# Altium schematic sheet GaN_Dead_Time.SchDoc
size A4
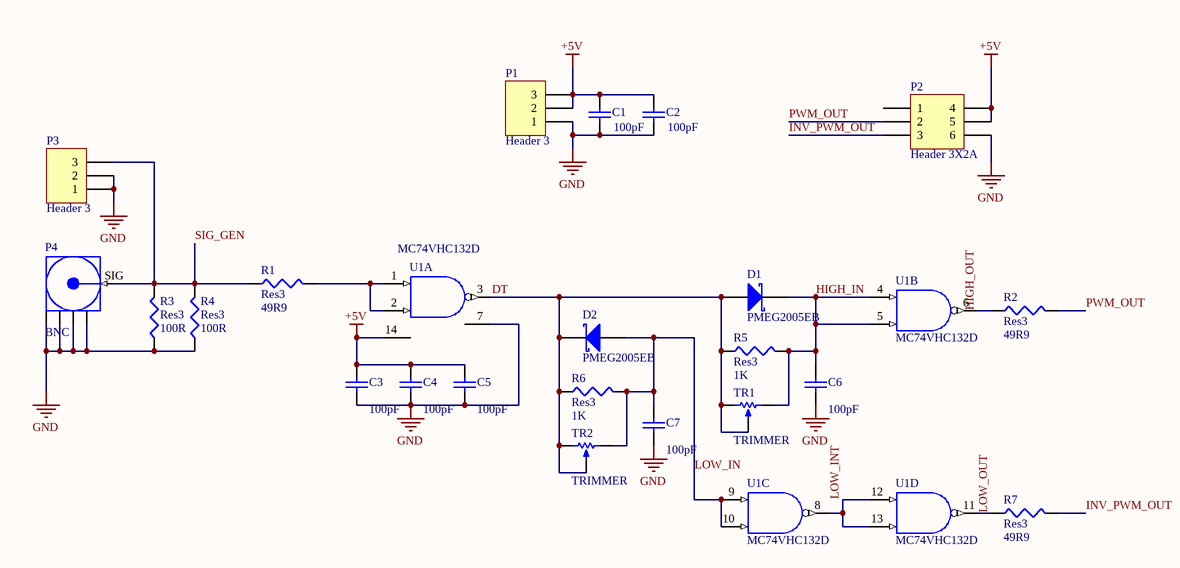
[diagram p0: GaN_Dead_Time.SchDoc]

## Parts
C1  value 100pF  [1206 IPC Low Density]  (hidden comment: Cap Semi)
C2  value 100pF  [1206 IPC Low Density]  (hidden comment: Cap Semi)
C3  value 100pF  [0603 IPC Low Density]  (hidden comment: Cap Semi)
C4  value 100pF  [0603 IPC Low Density]  (hidden comment: Cap Semi)
C5  value 100pF  [0603 IPC Low Density]  (hidden comment: Cap Semi)
C6  value 100pF  [0603 IPC Low Density]  (hidden comment: Cap Semi)
C7  value 100pF  [0603 IPC Low Density]  (hidden comment: Cap Semi)
D1  PMEG2005EB  [SOD-523]
D2  PMEG2005EB  [SOD-523]
P1  Header 3  [HDR1X3]
P2  Header 3X2A  [HDR2X3_CEN]
P3  Header 3  [HDR1X3]
P4  BNC  [BNC]
R1  Res3  value 49R9  [RESISTOR 0603]
R2  Res3  value 49R9  [RESISTOR 0603]
R3  Res3  value 100R  [RESISTOR 1206]
R4  Res3  value 100R  [RESISTOR 1206]
R5  Res3  value 1K  [RESISTOR 0603]
R6  Res3  value 1K  [RESISTOR 0603]
R7  Res3  value 49R9  [RESISTOR 0603]
TR1  TRIMMER  [3296W]
TR2  TRIMMER  [3296W]
U1  MC74VHC132D  [751A-03_M]  (parts A,B,C,D of 4)

## Nets
+5V: C1.2 C2.2 C3.2 C4.2 C5.2 P1.2 P1.3 P2.4 P2.5 U1.14(VDD)  [also labelled VDD]
GND: C1.1 C2.1 C3.1 C4.1 C5.1 C6.1 C7.1 P1.1 P2.6 P3.1 P3.2 P4.GND R3.1 R4.1 U1.7(GND)
DT: D1.1(A) D2.3(K) R5.1 R6.1 TR1.1(TOP) TR1.2(TAP) TR2.1(TOP) TR2.2(TAP) U1.3(Y)
HIGH_IN: C6.2 D1.3(K) R5.2 TR1.3(BOT) U1.4(A) U1.5(B)
HIGH_OUT: R2.1 U1.6(Y)
INV_PWM_OUT: P2.3 R7.2
LOW_IN: C7.2 D2.1(A) R6.2 TR2.3(BOT) U1.9(A) U1.10(B)
LOW_INT: U1.8(Y) U1.12(A) U1.13(B)
LOW_OUT: R7.1 U1.11(Y)
PWM_OUT: P2.2 R2.2
SIG_GEN: P3.3 P4.SIG(Signal) R1.1 R3.2 R4.2
NetR1_2: R1.2 U1.1(A) U1.2(B)

Not connected (* = marked no-connect by the designer): P2 1

## Library data of the parts
C1-C7 = Cap Semi: Capacitor (Semiconductor SIM Model); Published: 8-Jun-2000; LatestRevisionDate: 29-May-2009; LatestRevisionNote: IPC-7351 Footprint Added.; PackageReference: C1206; Publisher: Altium Limited; PackageDescription: Chip Capacitor
D1 D2 = PMEG2005EB: Schottky Diode  SOD-523
P1 P3 = Header 3: Header, 3-Pin; LatestRevisionDate: 17-Jul-2002; LatestRevisionNote: Re-released for DXP Platform.; Publisher: Altium Limited
P2 = Header 3X2A: Header, 3-Pin, Dual row; LatestRevisionDate: 17-Jul-2002; LatestRevisionNote: Re-released for DXP Platform.; Publisher: Altium Limited
P4 = BNC: Straight 50Ω Through Hole BNC Connector; PackageDocument: Rev. A, 16-Jun-1997; PCB_Layout: Complies with manufacturer's recommendation.; DrillSize: Corresponds to nominal value.; Published: 15-Jul-2004; LatestRevisionDate: 15-Jul-2004; LatestRevisionNote: Component Replaced.; DatasheetDocument: 30-May-2003; PackageReference: 908-21103; Publisher: Altium Limited; ComponentLink1Description: Manufacturer Link; ComponentLink1URL: http://www.amphenolrf.com/
R1-R7 = Res3: Resistor; Published: 8-Jun-2000; LatestRevisionDate: 29-May-2009; LatestRevisionNote: IPC-7351 Footprint Added.; PackageReference: J1-0603; Publisher: Altium Limited; PackageDescription: Chip Resistor
TR1 TR2 = TRIMMER 3296W
U1 = MC74VHC132D: Quad 2-Input NAND Schmitt Trigger; Published: 15-Apr-2002; LatestRevisionDate: 13-Apr-2006; LatestRevisionNote: IPC-7351 Footprint Added.; DatasheetVersion: 1997; PackageReference: 751A-03; Publisher: Altium Limited; PackageDescription: 14-Pin Small Outline Integrated Circuit 1.27 mm Pitch; Code_JEDEC: MS-012-AB; Code_IPC: SOIC127P600-14; ComponentLink1Description: Manufacturer Link; ComponentLink1URL: http://www.onsemi.com/; ComponentLink2Description: Datasheet; ComponentLink2URL: http://www.onsemi.com/pub/Collateral/MC74VHC132-D.PDF